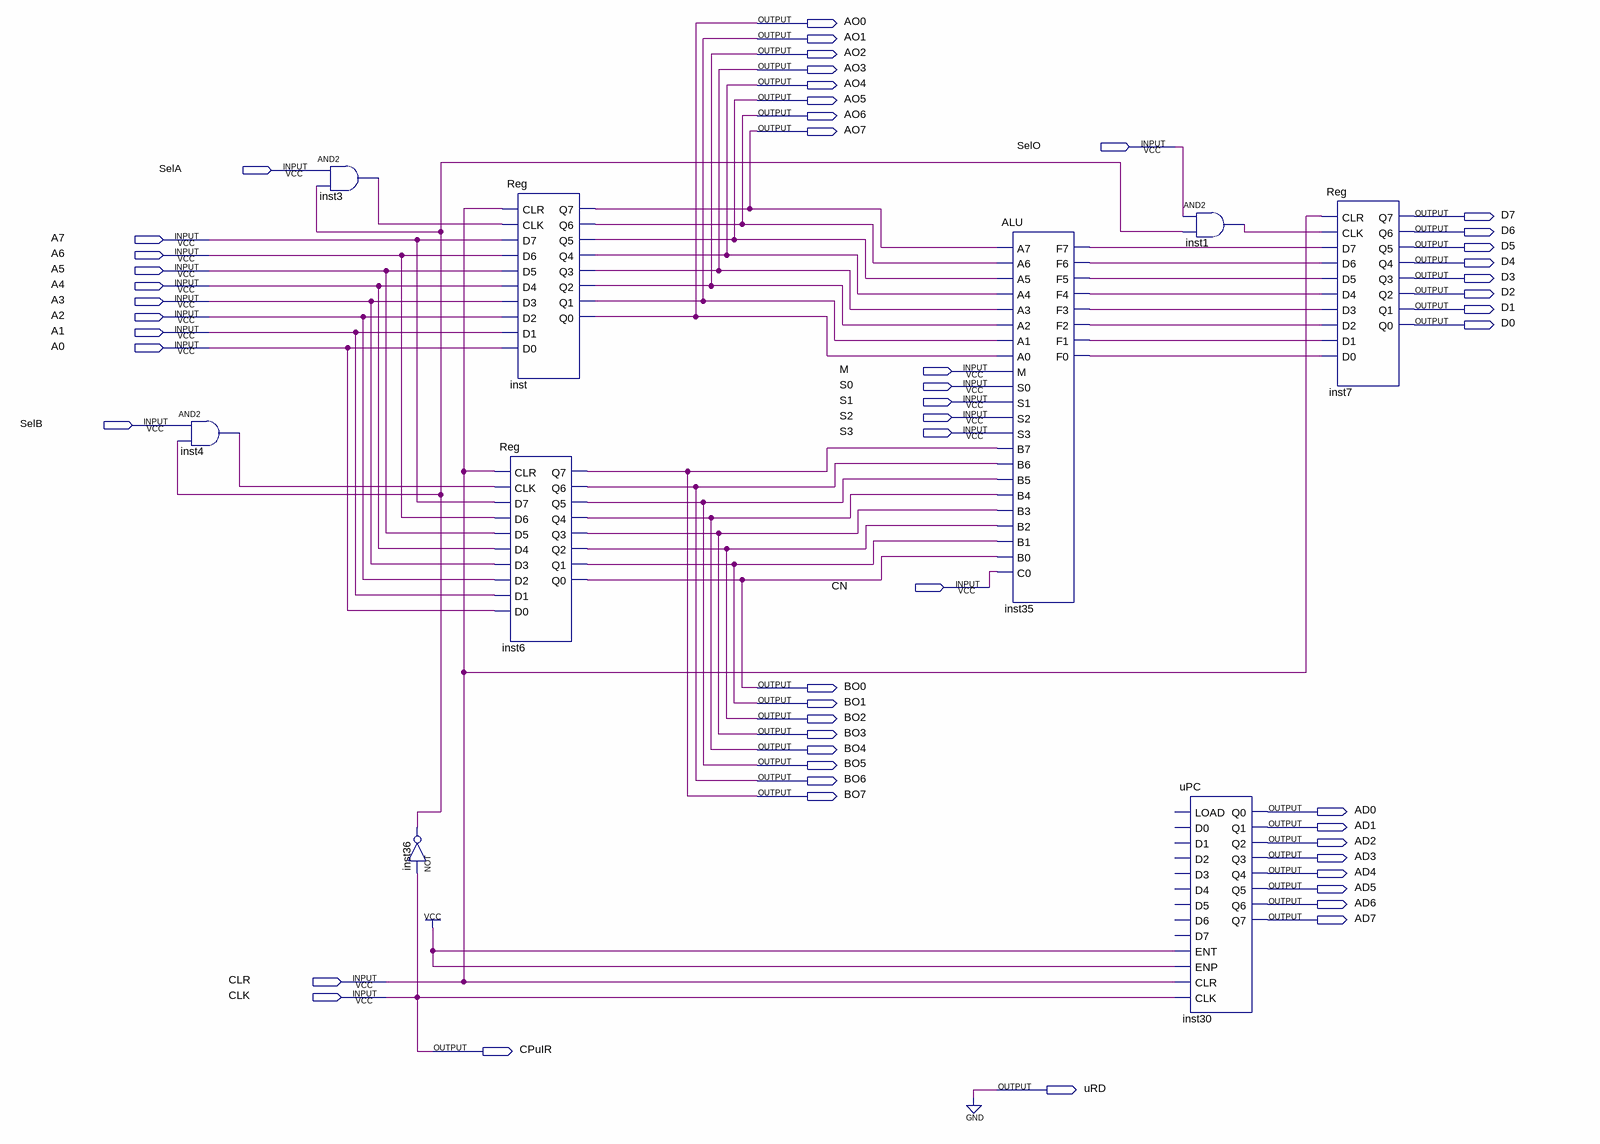
[diagram p0: schematic sheet]
// Quartus schematic EXP1.bdf as structural Verilog: 9 symbols, 53 pins
module EXP1 (
  input  SelO,
  input  SelA,
  input  A7,
  input  A6,
  input  A5,
  input  A4,
  input  A3,
  input  A2,
  input  A1,
  input  A0,
  input  M,
  input  S0,
  input  S1,
  input  S2,
  input  SelB,
  input  S3,
  input  CN,
  input  CLR,
  input  CLK,
  output AO0,
  output AO1,
  output AO2,
  output AO3,
  output AO4,
  output AO5,
  output AO6,
  output AO7,
  output D7,
  output D6,
  output D5,
  output D4,
  output D3,
  output D2,
  output D1,
  output D0,
  output BO0,
  output BO1,
  output BO2,
  output BO3,
  output BO4,
  output BO5,
  output BO6,
  output BO7,
  output AD0,
  output AD1,
  output AD2,
  output AD3,
  output AD4,
  output AD5,
  output AD6,
  output AD7,
  output CPuIR,
  output uRD
);

  wire inst1_out, inst3_out, inst4_out, inst35_f0, inst35_f1, inst35_f2, inst35_f3, inst35_f4, inst35_f5,
       inst35_f6, inst35_f7, inst36_out;

  and inst4 (inst4_out, SelB, inst36_out);
  and inst3 (inst3_out, SelA, inst36_out);
  not inst36 (inst36_out, CLK);
  Reg inst (
    .CLR(CLR), .CLK(inst3_out), .D7(A7), .D6(A6), .D5(A5), .D4(A4), .D3(A3), .D2(A2), .D1(A1), .D0(A0),
    .Q7(AO7), .Q6(AO6), .Q5(AO5), .Q4(AO4), .Q3(AO3), .Q2(AO2), .Q1(AO1), .Q0(AO0));
  Reg inst6 (
    .CLR(CLR), .CLK(inst4_out), .D7(A7), .D6(A6), .D5(A5), .D4(A4), .D3(A3), .D2(A2), .D1(A1), .D0(A0),
    .Q7(BO7), .Q6(BO6), .Q5(BO5), .Q4(BO4), .Q3(BO3), .Q2(BO2), .Q1(BO1), .Q0(BO0));
  ALU inst35 (
    .A7(AO7), .A6(AO6), .A5(AO5), .A4(AO4), .A3(AO3), .A2(AO2), .A1(AO1), .A0(AO0), .M(M), .S0(S0), .S1(S1),
    .S2(S2), .S3(S3), .B7(BO7), .B6(BO6), .B5(BO5), .B4(BO4), .B3(BO3), .B2(BO2), .B1(BO1), .B0(BO0),
    .C0(CN), .F7(inst35_f7), .F6(inst35_f6), .F5(inst35_f5), .F4(inst35_f4), .F3(inst35_f3), .F2(inst35_f2),
    .F1(inst35_f1), .F0(inst35_f0));
  and inst1 (inst1_out, SelO, inst36_out);
  uPC inst30 (
    .ENT(1'b1), .ENP(1'b1), .CLR(CLR), .CLK(CLK), .Q0(AD0), .Q1(AD1), .Q2(AD2), .Q3(AD3), .Q4(AD4), .Q5(AD5),
    .Q6(AD6), .Q7(AD7));  // open: LOAD, D0, D1, D2, D3, D4, D5, D6, D7
  Reg inst7 (
    .CLR(CLR), .CLK(inst1_out), .D7(inst35_f7), .D6(inst35_f6), .D5(inst35_f5), .D4(inst35_f4),
    .D3(inst35_f3), .D2(inst35_f2), .D1(inst35_f1), .D0(inst35_f0), .Q7(D7), .Q6(D6), .Q5(D5), .Q4(D4),
    .Q3(D3), .Q2(D2), .Q1(D1), .Q0(D0));

  assign CPuIR = CLK;
  assign uRD = 1'b0;
endmodule
